# Altium project Widora-BIT3-NEO-Prj.PrjPCB
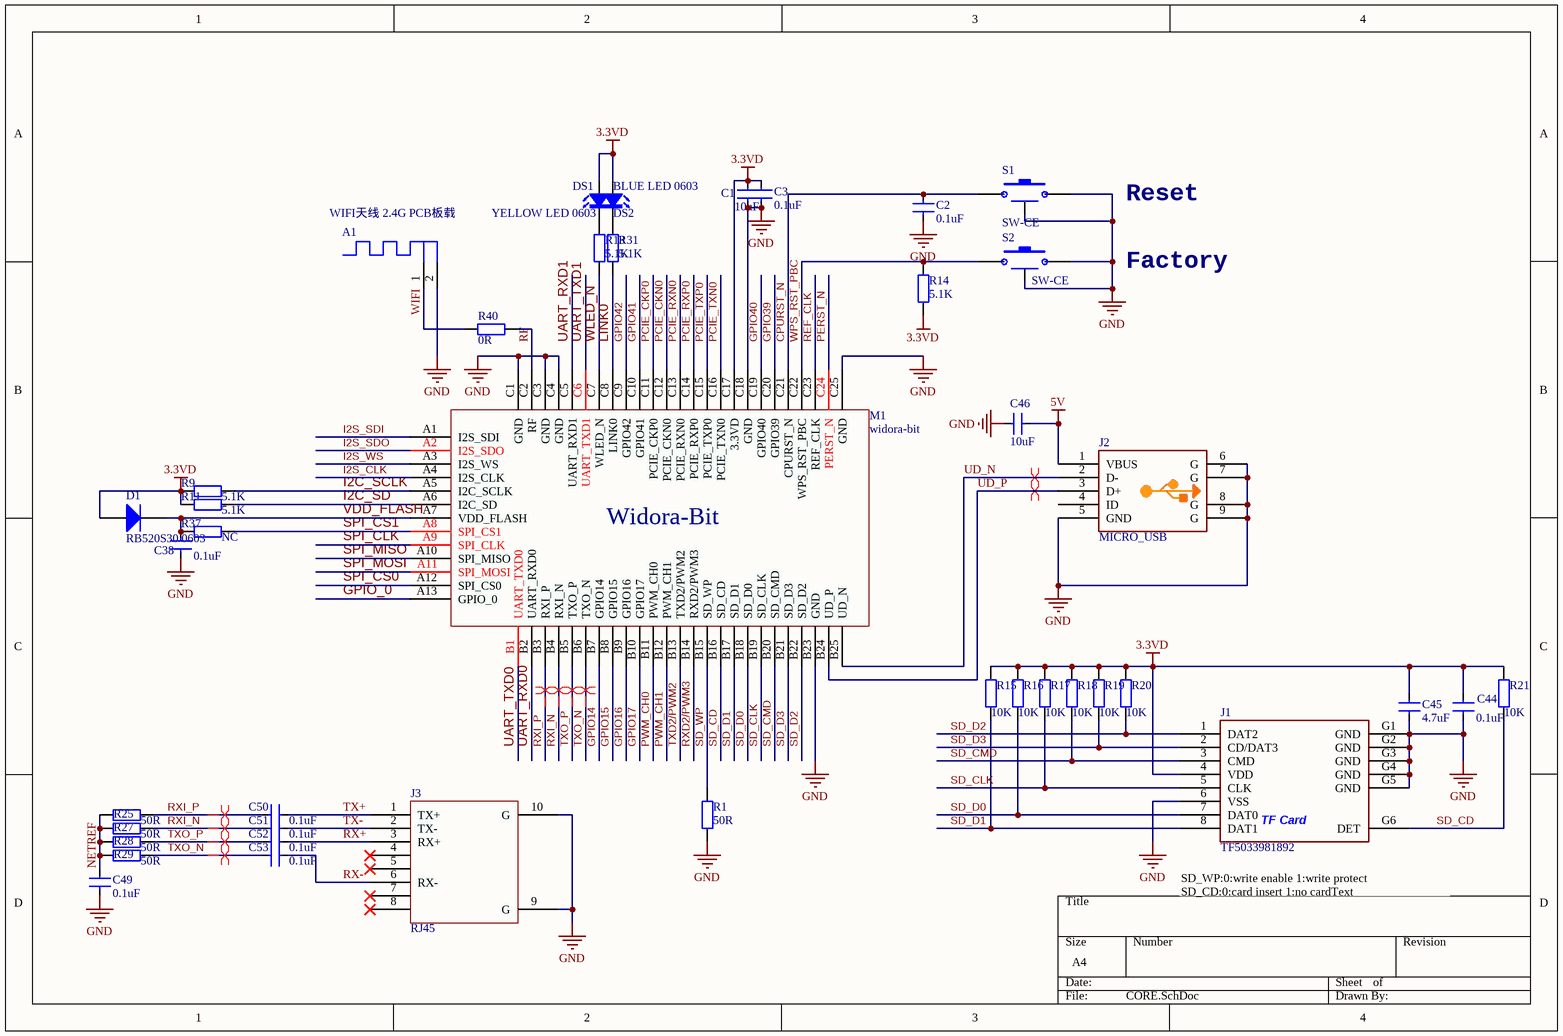
[diagram p0: CORE.SchDoc]
4 sheets, 76 parts. Net scope: global (net labels, ports and power ports of the same name join across sheets).
Board file: Widora-BIT3-NEO.PcbDoc
Sheets:
  CORE.SchDoc
  Expand.SchDoc
  POWER-USB2TTL.SchDoc
  AUDIO.SchDoc

## Sheet CORE.SchDoc
size A4

### Parts
A1  WIFI天线 2.4G PCB板载  [2.4G - mirror]
C1  10uF  [0805C]
C2  0.1uF  [C0402]
C3  0.1uF  [C0402]
C38  0.1uF  [C0402]
C44  0.1uF  [C0402]
C45  4.7uF  [C0402]
C46  10uF  [0805C]
C49  0.1uF  [C0402]
C50  0.1uF  [C0402]
C51  0.1uF  [C0402]
C52  0.1uF  [C0402]
C53  0.1uF  [C0402]
D1  RB520S30 0603  [SOD523]
DS1  YELLOW LED 0603  [LED0603]
DS2  BLUE LED 0603  [LED0603]
J1  TF5033981892  [TFCARD]
J2  MICRO_USB  [MICROUSB]
J3  RJ45  [RJ45]
M1  widora-bit  [widora-core]
R1  50R  [R0402]
R9  5.1K  [R0402]
R11  5.1K  [R0402]
R13  5.1K  [R0402]
R14  5.1K  [R0402]
R15  10K  [R0402]
R16  10K  [R0402]
R17  10K  [R0402]
R18  10K  [R0402]
R19  10K  [R0402]
R20  10K  [R0402]
R21  10K  [R0402]
R25  50R  [R0402]
R27  50R  [R0402]
R28  50R  [R0402]
R29  50R  [R0402]
R31  5.1K  [R0402]
R37  NC  [R0402]
R40  0R  [R0402]
S1  SW-CE  [KEY-A06]
S2  SW-CE  [KEY-A06]

### Nets
3.3VD: C1.2 C3.2 C44.1 C45.1 D1.A DS1.A DS2.A J1.4(VDD) M1.C17(3.3VD) R9.2 R11.2 R14.1 R15.1 R16.1 R17.1 R18.1 R19.1 R20.1 R21.1
5V: C46.1 J2.1(VBUS)
GND: A1.2(G) C1.1 C2.1 C3.1 C38.1 C44.2 C45.2 C46.2 C49.1 J1.6(VSS) J1.G1(GND) J1.G2(GND) J1.G3(GND) J1.G4(GND) J1.G5(GND) J2.5(GND) J2.6(G) J2.7(G) J2.8(G) J2.9(G) J3.9(G) J3.10(G) M1.B23(GND) M1.C1(GND) M1.C3(GND) M1.C4(GND) M1.C18(GND) M1.C25(GND) R1.2 S1.0 S1.2 S2.0 S2.1
VDD_FLASH: C38.2 D1.K M1.A7(VDD_FLASH) R37.1
CPURST_N: C2.2 M1.C21(CPURST_N) S1.1
GPIO14: M1.B7(GPIO14)
GPIO15: M1.B8(GPIO15)
GPIO16: M1.B9(GPIO16)
GPIO17: M1.B10(GPIO17)
GPIO39: M1.C20(GPIO39)
GPIO40: M1.C19(GPIO40)
GPIO41: M1.C10(GPIO41)
GPIO42: M1.C9(GPIO42)
GPIO_0: M1.A13(GPIO_0)
I2C_SCLK: M1.A5(I2C_SCLK) R9.1
I2C_SD: M1.A6(I2C_SD) R11.1
I2S_CLK: M1.A4(I2S_CLK)
I2S_SDI: M1.A1(I2S_SDI)
I2S_SDO: M1.A2(I2S_SDO)
I2S_WS: M1.A3(I2S_WS)
LINK0: M1.C8(LINK0) R31.2
NETREF: C49.2 R25.2 R27.2 R28.2 R29.2
PCIE_CKN0: M1.C12(PCIE_CKN0)
PCIE_CKP0: M1.C11(PCIE_CKP0)
PCIE_RXN0: M1.C13(PCIE_RXN0)
PCIE_RXP0: M1.C14(PCIE_RXP0)
PCIE_TXN0: M1.C16(PCIE_TXN0)
PCIE_TXP0: M1.C15(PCIE_TXP0)
PERST_N: M1.C24(PERST_N)
PWM_CH0: M1.B11(PWM_CH0)
PWM_CH1: M1.B12(PWM_CH1)
REF_CLK: M1.C23(REF_CLK)
RF: M1.C2(RF) R40.1
RX+: C52.2 J3.3(RX+)
RX-: C53.2 J3.6(RX-)
RXD2/PWM3: M1.B14(RXD2/PWM3)
RXI_N: C51.1 M1.B4(RXI_N) R27.1
RXI_P: C50.1 M1.B3(RXI_P) R25.1
SD_CD: J1.G6(DET) M1.B16(SD_CD) R21.2
SD_CLK: J1.5(CLK) M1.B19(SD_CLK) R17.2
SD_CMD: J1.3(CMD) M1.B20(SD_CMD) R18.2
SD_D0: J1.7(DAT0) M1.B18(SD_D0) R16.2
SD_D1: J1.8(DAT1) M1.B17(SD_D1) R15.2
SD_D2: J1.1(DAT2) M1.B22(SD_D2) R20.2
SD_D3: J1.2(CD/DAT3) M1.B21(SD_D3) R19.2
SD_WP: M1.B15(SD_WP) R1.1
SPI_CLK: M1.A9(SPI_CLK)
SPI_CS0: M1.A12(SPI_CS0)
SPI_CS1: M1.A8(SPI_CS1) R37.2
SPI_MISO: M1.A10(SPI_MISO)
SPI_MOSI: M1.A11(SPI_MOSI)
TX+: C50.2 J3.1(TX+)
TX-: C51.2 J3.2(TX-)
TXD2/PWM2: M1.B13(TXD2/PWM2)
TXO_N: C53.1 M1.B6(TXO_N) R29.1
TXO_P: C52.1 M1.B5(TXO_P) R28.1
UART_RXD0: M1.B2(UART_RXD0)
UART_RXD1: M1.C5(UART_RXD1)
UART_TXD0: M1.B1(UART_TXD0)
UART_TXD1: M1.C6(UART_TXD1)
UD_N: J2.2(D-) M1.B25(UD_N)
UD_P: J2.3(D+) M1.B24(UD_P)
WIFI: A1.1 R40.2
WLED_N: M1.C7(WLED_N) R13.2
WPS_RST_PBC: M1.C22(WPS_RST_PBC) R14.2 S2.2
NetDS1_K: DS1.K R13.1
NetDS2_K: DS2.K R31.1

Not connected (* = marked no-connect by the designer): J2 4(ID); J3 4* 5* 7* 8*

### Layout directives
differential pair: RXI_N, RXI_P, TXO_N, TXO_P, UD_N, UD_P

### Notes on the sheet
- Reset
- Factory
- (near J1) SD_WP:0:write enable 1:write protect
  SD_CD:0:card insert 1:no cardText
- (in symbol TF5033981892) TF Card
- (in symbol widora-bit) Widora-Bit

### Library data of the parts
A1 = ANT2.4G
C1-C3 C38 C44-C46 C49-C53 = CAP: 普通小电容
D1 = Diode: 普通二极管
DS1 = LED: 黄色0603发光二极管
DS2 = LED: 蓝色0603发光二极管
J1 = TF5033981892: Molex TF 卡座
J3 = RJ45: RJ45不带网络变压器
R1 R9 R11 R13-R21 R25 R27-R29 R31 R37 R40 = RES: 普通电阻

## Sheet Expand.SchDoc
size A; DocumentNumber: 4; SheetNumber: 4; SheetTotal: 7
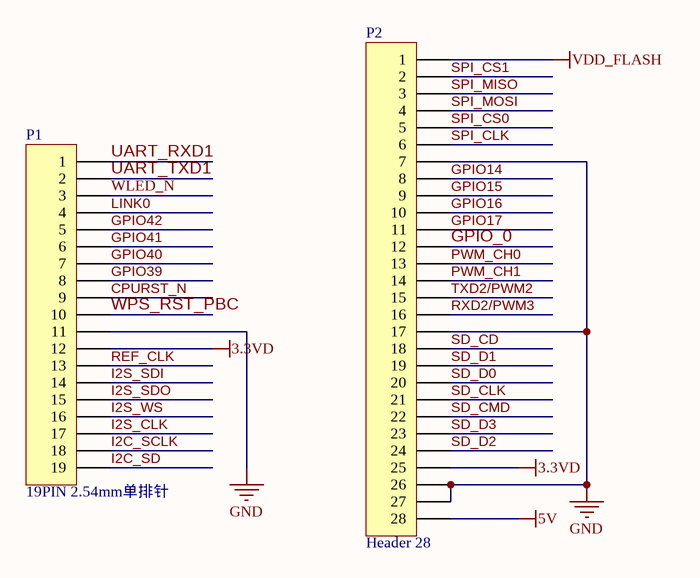
[diagram p1: Expand.SchDoc]

### Parts
P1  19PIN 2.54mm单排针  [HDR1X19]
P2  Header 28  [HDR1X28]

### Nets
3.3VD: P1.12 P2.25
5V: P2.28
GND: P1.11 P2.7 P2.17 P2.26 P2.27
VDD_FLASH: P2.1
CPURST_N: P1.9
GPIO14: P2.8
GPIO15: P2.9
GPIO16: P2.10
GPIO17: P2.11
GPIO39: P1.8
GPIO40: P1.7
GPIO41: P1.6
GPIO42: P1.5
GPIO_0: P2.12
I2C_SCLK: P1.18
I2C_SD: P1.19
I2S_CLK: P1.17
I2S_SDI: P1.14
I2S_SDO: P1.15
I2S_WS: P1.16
LINK0: P1.4
PWM_CH0: P2.13
PWM_CH1: P2.14
REF_CLK: P1.13
RXD2/PWM3: P2.16
SD_CD: P2.18
SD_CLK: P2.21
SD_CMD: P2.22
SD_D0: P2.20
SD_D1: P2.19
SD_D2: P2.24
SD_D3: P2.23
SPI_CLK: P2.6
SPI_CS0: P2.5
SPI_CS1: P2.2
SPI_MISO: P2.3
SPI_MOSI: P2.4
TXD2/PWM2: P2.15
UART_RXD1: P1.1
UART_TXD1: P1.2
WLED_N: P1.3
WPS_RST_PBC: P1.10

### Library data of the parts
P1 = Header 19: Header, 19-Pin; LatestRevisionDate: 17-Jul-2002; LatestRevisionNote: Re-released for DXP Platform.; Publisher: Altium Limited
P2 = Header 28: Header, 28-Pin; LatestRevisionDate: 17-Jul-2002; LatestRevisionNote: Re-released for DXP Platform.; Publisher: Altium Limited

## Sheet POWER-USB2TTL.SchDoc
size A4; DocumentNumber: 7; SheetNumber: 7; SheetTotal: 7
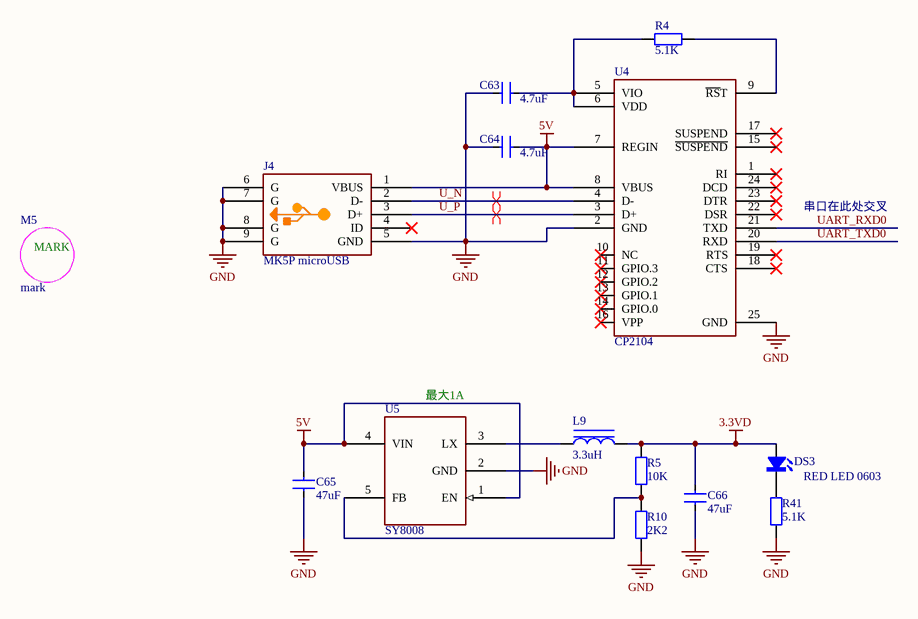
[diagram p2: POWER-USB2TTL.SchDoc]

### Parts
C63  4.7uF  [C0402]
C64  4.7uF  [C0402]
C65  47uF  [0805C]
C66  47uF  [0805C]
DS3  RED LED 0603  [LED0603]
J4  MK5P microUSB  [MICROUSB]
L9  3.3uH  [VLS3012E]
M5  mark  [ZY_UR-3X2]
R4  5.1K  [R0402]
R5  10K  [R0402]
R10  2K2  [R0402]
R41  5.1K  [R0402]
U4  CP2104  [QFN24]
U5  SY8008  [SOT23-5]

### Nets
3.3VD: C66.2 DS3.A L9.1 R5.2
5V: C64.2 C65.1 J4.1(VBUS) U4.7(REGIN) U4.8(VBUS) U5.1(EN) U5.4(VIN)
GND: C63.2 C64.1 C65.2 C66.1 J4.5(GND) J4.6(G) J4.7(G) J4.8(G) J4.9(G) R10.1 R41.2 U4.2(GND) U4.25(GND) U5.2(GND)
U_N: J4.2(D-) U4.4(D-)
U_P: J4.3(D+) U4.3(D+)
UART_RXD0: U4.21(TXD)
UART_TXD0: U4.20(RXD)
NetC63_1: C63.1 R4.1 U4.5(VIO) U4.6(VDD)
NetDS3_K: DS3.K R41.1
NetL9_2: L9.2 U5.3(LX)
NetR4_2: R4.2 U4.9(~{RS}T)
NetR5_1: R5.1 R10.2 U5.5(FB)

Not connected (* = marked no-connect by the designer): J4 4(ID)*; U4 1(RI)* 10(NC)* 11(GPIO.3)* 12(GPIO.2)* 13(GPIO.1)* 14(GPIO.0)* 15(~{SUSPEND})* 16(VPP)* 17(SUSPEND)* 18(CTS)* 19(RTS)* 22(DSR)* 23(DTR)* 24(DCD)*

### Layout directives
differential pair: U_N, U_P

### Notes on the sheet
- 串口在此处交叉
- (near U5) 最大1A
- (in symbol mark) MARK

### Library data of the parts
C63-C66 = CAP: 普通小电容
DS3 = LED: 红色0603发光二极管
J4 = MICRO_USB: 4固定脚microUSB座
L9 = L: vls3012小电感
R4 R5 R10 R41 = RES: 普通电阻

## Sheet AUDIO.SchDoc
size A4
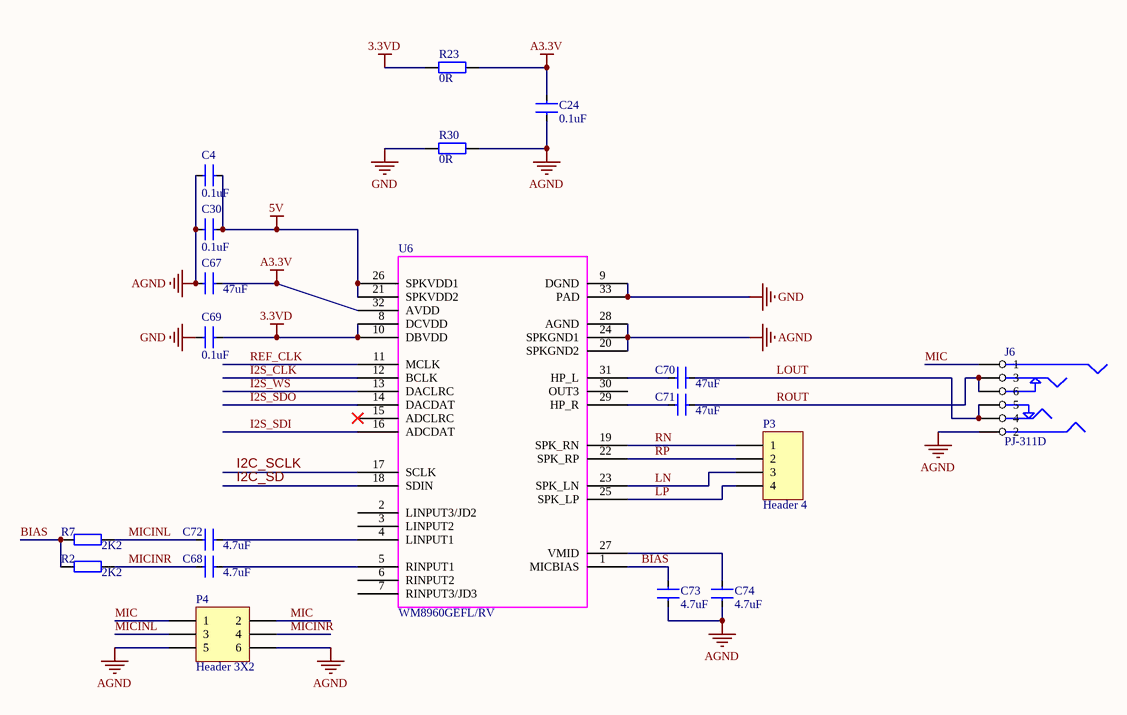
[diagram p3: AUDIO.SchDoc]

### Parts
C4  0.1uF  [C0402]
C24  0.1uF  [C0402]
C30  0.1uF  [C0402]
C67  47uF  [0805C]
C68  4.7uF  [C0402]
C69  0.1uF  [C0402]
C70  47uF  [0805C]
C71  47uF  [0805C]
C72  4.7uF  [C0402]
C73  4.7uF  [C0402]
C74  4.7uF  [C0402]
J6  PJ-311D  [PJ311D]
P3  Header 4  [HDR1X4 -2.0]
P4  Header 3X2  [HDR2X3 - 2.0]
R2  2K2  [R0402]
R7  2K2  [R0402]
R23  0R  [R0402]
R30  0R  [R0402]
U6  WM8960GEFL/RV  [QFN50P500X500X100-33N]

### Nets
3.3VD: C69.2 R23.1 U6.8(DCVDD) U6.10(DBVDD)
5V: C4.1 C30.1 U6.21(SPKVDD2) U6.26(SPKVDD1)
A3.3V: C24.2 C67.2 R23.2 U6.32(AVDD)
AGND: C4.2 C24.1 C30.2 C67.1 C73.1 C74.1 J6.2 P4.5 P4.6 R30.2 U6.20(SPKGND2) U6.24(SPKGND1) U6.28(AGND)
GND: C69.1 R30.1 U6.9(DGND) U6.33(PAD)
BIAS: C73.2 R2.1 R7.1 U6.1(MICBIAS)
I2C_SCLK: U6.17(SCLK)
I2C_SD: U6.18(SDIN)
I2S_CLK: U6.12(BCLK)
I2S_SDI: U6.16(ADCDAT)
I2S_SDO: U6.14(DACDAT)
I2S_WS: U6.13(DACLRC)
LN: P3.3 U6.23(SPK_LN)
LOUT: C70.1 J6.4 J6.5
LP: P3.4 U6.25(SPK_LP)
MIC: J6.1 P4.1 P4.2
MICINL: C72.2 P4.3 R7.2
MICINR: C68.2 P4.4 R2.2
REF_CLK: U6.11(MCLK)
RN: P3.1 U6.19(SPK_RN)
ROUT: C71.1 J6.3 J6.6
RP: P3.2 U6.22(SPK_RP)
NetC68_1: C68.1 U6.5(RINPUT1)
NetC70_2: C70.2 U6.31(HP_L)
NetC71_2: C71.2 U6.29(HP_R)
NetC72_1: C72.1 U6.4(LINPUT1)
NetC74_2: C74.2 U6.27(VMID)

Not connected (* = marked no-connect by the designer): U6 2(LINPUT3/JD2) 3(LINPUT2) 6(RINPUT2) 7(RINPUT3/JD3) 15(ADCLRC)* 30(OUT3)

### Library data of the parts
C4 C24 C30 C67-C74 = CAP: 普通小电容
P3 = Header 4: Header, 4-Pin; LatestRevisionDate: 17-Jul-2002; LatestRevisionNote: Re-released for DXP Platform.; Publisher: Altium Limited
P4 = Header 3X2: Header, 3-Pin, Dual row; LatestRevisionDate: 17-Jul-2002; LatestRevisionNote: Re-released for DXP Platform.; Publisher: Altium Limited
R2 R7 R23 R30 = RES: 普通电阻

## Nets that join several sheets
3.3VD: CORE (19 pins), Expand (P1.12 P2.25), POWER-USB2TTL (C66.2 DS3.A L9.1 R5.2), AUDIO (C69.2 R23.1 U6.8 U6.10)
5V: CORE (C46.1 J2.1), Expand (P2.28), POWER-USB2TTL (7 pins), AUDIO (C4.1 C30.1 U6.21 U6.26)
GND: CORE (33 pins), Expand (5 pins), POWER-USB2TTL (14 pins), AUDIO (C69.1 R30.1 U6.9 U6.33)
VDD_FLASH: CORE (C38.2 D1.K M1.A7 R37.1), Expand (P2.1)
CPURST_N: CORE (C2.2 M1.C21 S1.1), Expand (P1.9)
GPIO14: CORE (M1.B7), Expand (P2.8)
GPIO15: CORE (M1.B8), Expand (P2.9)
GPIO16: CORE (M1.B9), Expand (P2.10)
GPIO17: CORE (M1.B10), Expand (P2.11)
GPIO39: CORE (M1.C20), Expand (P1.8)
GPIO40: CORE (M1.C19), Expand (P1.7)
GPIO41: CORE (M1.C10), Expand (P1.6)
GPIO42: CORE (M1.C9), Expand (P1.5)
GPIO_0: CORE (M1.A13), Expand (P2.12)
I2C_SCLK: CORE (M1.A5 R9.1), Expand (P1.18), AUDIO (U6.17)
I2C_SD: CORE (M1.A6 R11.1), Expand (P1.19), AUDIO (U6.18)
I2S_CLK: CORE (M1.A4), Expand (P1.17), AUDIO (U6.12)
I2S_SDI: CORE (M1.A1), Expand (P1.14), AUDIO (U6.16)
I2S_SDO: CORE (M1.A2), Expand (P1.15), AUDIO (U6.14)
I2S_WS: CORE (M1.A3), Expand (P1.16), AUDIO (U6.13)
LINK0: CORE (M1.C8 R31.2), Expand (P1.4)
PWM_CH0: CORE (M1.B11), Expand (P2.13)
PWM_CH1: CORE (M1.B12), Expand (P2.14)
REF_CLK: CORE (M1.C23), Expand (P1.13), AUDIO (U6.11)
RXD2/PWM3: CORE (M1.B14), Expand (P2.16)
SD_CD: CORE (J1.G6 M1.B16 R21.2), Expand (P2.18)
SD_CLK: CORE (J1.5 M1.B19 R17.2), Expand (P2.21)
SD_CMD: CORE (J1.3 M1.B20 R18.2), Expand (P2.22)
SD_D0: CORE (J1.7 M1.B18 R16.2), Expand (P2.20)
SD_D1: CORE (J1.8 M1.B17 R15.2), Expand (P2.19)
SD_D2: CORE (J1.1 M1.B22 R20.2), Expand (P2.24)
SD_D3: CORE (J1.2 M1.B21 R19.2), Expand (P2.23)
SPI_CLK: CORE (M1.A9), Expand (P2.6)
SPI_CS0: CORE (M1.A12), Expand (P2.5)
SPI_CS1: CORE (M1.A8 R37.2), Expand (P2.2)
SPI_MISO: CORE (M1.A10), Expand (P2.3)
SPI_MOSI: CORE (M1.A11), Expand (P2.4)
TXD2/PWM2: CORE (M1.B13), Expand (P2.15)
UART_RXD0: CORE (M1.B2), POWER-USB2TTL (U4.21)
UART_RXD1: CORE (M1.C5), Expand (P1.1)
UART_TXD0: CORE (M1.B1), POWER-USB2TTL (U4.20)
UART_TXD1: CORE (M1.C6), Expand (P1.2)
WLED_N: CORE (M1.C7 R13.2), Expand (P1.3)
WPS_RST_PBC: CORE (M1.C22 R14.2 S2.2), Expand (P1.10)